# Altium schematic sheet DRIVERS_CONNECTORS.SchDoc: LEDBO - LTSN-N213EGBW (Drivers)
size B; Author: Sébastien Gélinas; Organization: SmartHalo; Address1: 5445 de Gaspé; Address2: Montréal, QC; Address3: Canada; Address4: H2T 3B2; Revision: 1; SheetNumber: 1; SheetTotal: 3
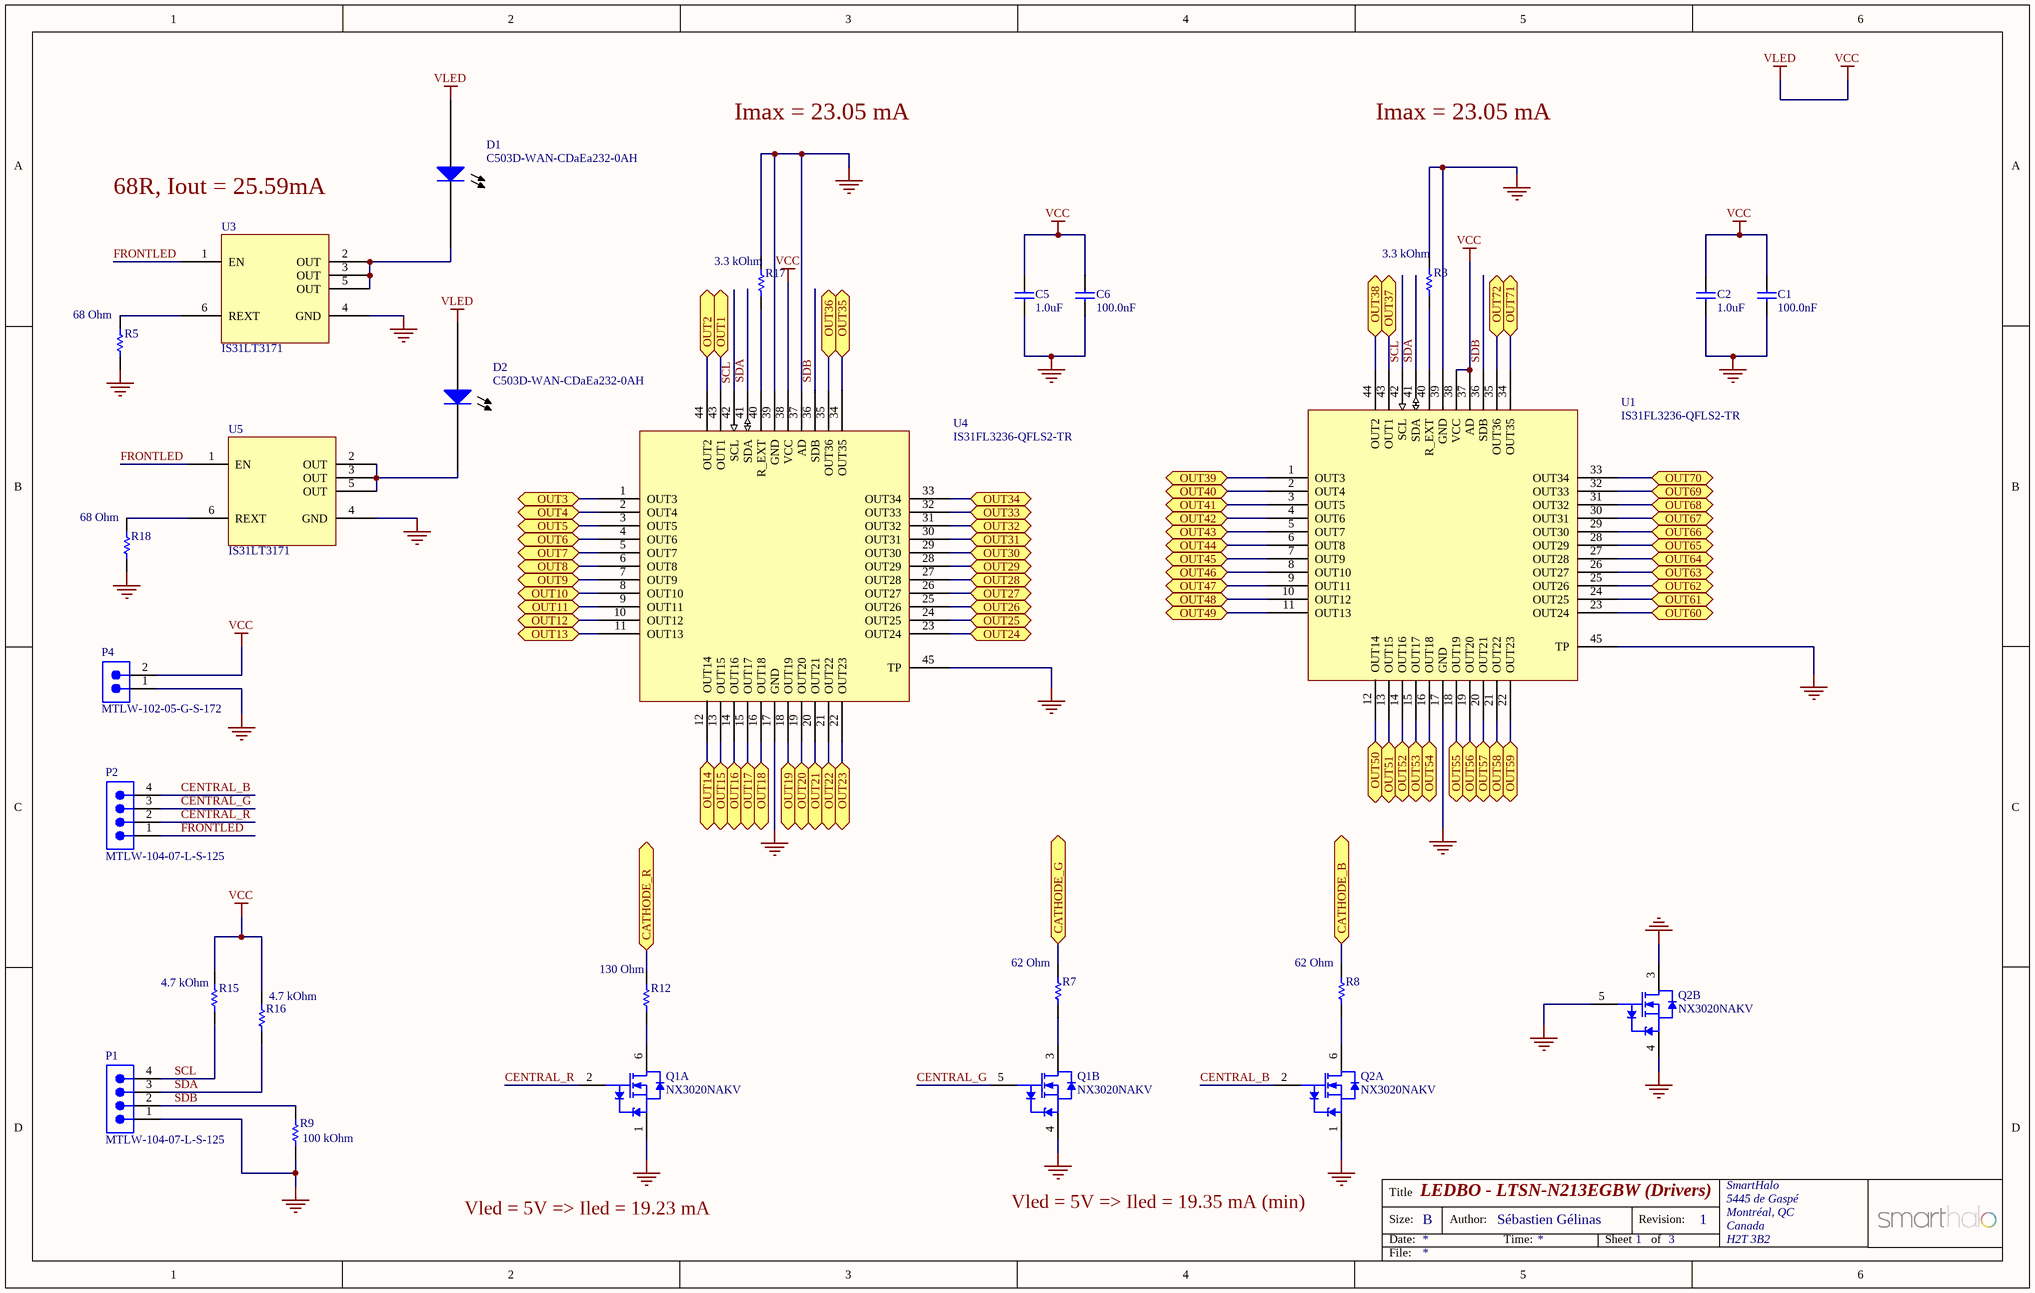
[diagram p0: DRIVERS_CONNECTORS.SchDoc]

## Parts
C1  100.0nF  [CAPC0603(1608)100_N]
C2  1.0uF  [CAPC0603(1608)100_N]
C5  1.0uF  [CAPC0603(1608)100_N]
C6  100.0nF  [CAPC0603(1608)100_N]
D1  C503D-WAN-CDaEa232-0AH  [FRONTLED_PADS]
D2  C503D-WAN-CDaEa232-0AH  [FRONTLED_PADS]
P1  MTLW-104-07-L-S-125  [SMTC-MTLW-104-07-X-S-125]  (no BOM)
P2  MTLW-104-07-L-S-125  [SMTC-MTLW-104-07-X-S-125]  (no BOM)
P4  MTLW-102-05-G-S-172  [SMTC-MTLW-102-05-X-S-172]  (no BOM)
Q1  NX3020NAKV  [SOT666]  (parts A,B of 2)
Q2  NX3020NAKV  [SOT666]  (parts A,B of 2)
R3  3.3 kOhm  [RESC0603(1608)_M]
R5  68 Ohm  [RESC0603(1608)_M]
R7  62 Ohm  [RESC0603(1608)_M]
R8  62 Ohm  [RESC0603(1608)_M]
R9  100 kOhm  [RESC0603(1608)_M]
R12  130 Ohm  [RESC0603(1608)_M]
R15  4.7 kOhm  [RESC0603(1608)_M]
R16  4.7 kOhm  [RESC0603(1608)_M]
R17  3.3 kOhm  [RESC0603(1608)_M]
R18  68 Ohm  [RESC0603(1608)_M]
U1  IS31FL3236-QFLS2-TR  [QFN-44]
U3  IS31LT3171  [SOT23-6]
U4  IS31FL3236-QFLS2-TR  [QFN-44]
U5  IS31LT3171  [SOT23-6]

## Ports
CATHODE_B, CATHODE_G, CATHODE_R, OUT1, OUT2, OUT3, OUT4, OUT5, OUT6, OUT7, OUT8, OUT9, OUT10, OUT11, OUT12, OUT13, OUT14, OUT15, OUT16, OUT17, OUT18, OUT19, OUT20, OUT21, OUT22, OUT23, OUT24, OUT25, OUT26, OUT27, OUT28, OUT29, OUT30, OUT31, OUT32, OUT33, OUT34, OUT35, OUT36, OUT37, OUT38, OUT39, OUT40, OUT41, OUT42, OUT43, OUT44, OUT45, OUT46, OUT47, OUT48, OUT49, OUT50, OUT51, OUT52, OUT53, OUT54, OUT55, OUT56, OUT57, OUT58, OUT59, OUT60, OUT61, OUT62, OUT63, OUT64, OUT65, OUT66, OUT67, OUT68, OUT69, OUT70, OUT71, OUT72

## Nets
GND: C1.2 C2.2 C5.2 C6.2 P1.1 P4.1 Q1.1(S1) Q1.4(S2) Q2.1(S1) Q2.3(D2) Q2.4(S2) Q2.5(G2) R3.2 R5.1 R9.1 R17.2 R18.1 U1.17(GND) U1.39(GND) U1.45(TP) U3.4(GND) U4.17(GND) U4.37(AD) U4.39(GND) U4.45(TP) U5.4(GND)
VCC: C1.1 C2.1 C5.1 C6.1 D1.1(Anode) D2.1(Anode) P4.2 R15.2 R16.2 U1.37(AD) U1.38(VCC) U4.38(VCC)  [also labelled VLED]
CATHODE_B: R8.2 ; port CATHODE_B
CATHODE_G: R7.2 ; port CATHODE_G
CATHODE_R: R12.2 ; port CATHODE_R
CENTRAL_B: P2.4 Q2.2(G1)
CENTRAL_G: P2.3 Q1.5(G2)
CENTRAL_R: P2.2 Q1.2(G1)
FRONTLED: P2.1 U3.1(EN) U5.1(EN)
OUT1: U4.43(OUT1) ; port OUT1
OUT2: U4.44(OUT2) ; port OUT2
OUT3: U4.1(OUT3) ; port OUT3
OUT4: U4.2(OUT4) ; port OUT4
OUT5: U4.3(OUT5) ; port OUT5
OUT6: U4.4(OUT6) ; port OUT6
OUT7: U4.5(OUT7) ; port OUT7
OUT8: U4.6(OUT8) ; port OUT8
OUT9: U4.7(OUT9) ; port OUT9
OUT10: U4.8(OUT10) ; port OUT10
OUT11: U4.9(OUT11) ; port OUT11
OUT12: U4.10(OUT12) ; port OUT12
OUT13: U4.11(OUT13) ; port OUT13
OUT14: U4.12(OUT14) ; port OUT14
OUT15: U4.13(OUT15) ; port OUT15
OUT16: U4.14(OUT16) ; port OUT16
OUT17: U4.15(OUT17) ; port OUT17
OUT18: U4.16(OUT18) ; port OUT18
OUT19: U4.18(OUT19) ; port OUT19
OUT20: U4.19(OUT20) ; port OUT20
OUT21: U4.20(OUT21) ; port OUT21
OUT22: U4.21(OUT22) ; port OUT22
OUT23: U4.22(OUT23) ; port OUT23
OUT24: U4.23(OUT24) ; port OUT24
OUT25: U4.24(OUT25) ; port OUT25
OUT26: U4.25(OUT26) ; port OUT26
OUT27: U4.26(OUT27) ; port OUT27
OUT28: U4.27(OUT28) ; port OUT28
OUT29: U4.28(OUT29) ; port OUT29
OUT30: U4.29(OUT30) ; port OUT30
OUT31: U4.30(OUT31) ; port OUT31
OUT32: U4.31(OUT32) ; port OUT32
OUT33: U4.32(OUT33) ; port OUT33
OUT34: U4.33(OUT34) ; port OUT34
OUT35: U4.34(OUT35) ; port OUT35
OUT36: U4.35(OUT36) ; port OUT36
OUT37: U1.43(OUT1) ; port OUT37
OUT38: U1.44(OUT2) ; port OUT38
OUT39: U1.1(OUT3) ; port OUT39
OUT40: U1.2(OUT4) ; port OUT40
OUT41: U1.3(OUT5) ; port OUT41
OUT42: U1.4(OUT6) ; port OUT42
OUT43: U1.5(OUT7) ; port OUT43
OUT44: U1.6(OUT8) ; port OUT44
OUT45: U1.7(OUT9) ; port OUT45
OUT46: U1.8(OUT10) ; port OUT46
OUT47: U1.9(OUT11) ; port OUT47
OUT48: U1.10(OUT12) ; port OUT48
OUT49: U1.11(OUT13) ; port OUT49
OUT50: U1.12(OUT14) ; port OUT50
OUT51: U1.13(OUT15) ; port OUT51
OUT52: U1.14(OUT16) ; port OUT52
OUT53: U1.15(OUT17) ; port OUT53
OUT54: U1.16(OUT18) ; port OUT54
OUT55: U1.18(OUT19) ; port OUT55
OUT56: U1.19(OUT20) ; port OUT56
OUT57: U1.20(OUT21) ; port OUT57
OUT58: U1.21(OUT22) ; port OUT58
OUT59: U1.22(OUT23) ; port OUT59
OUT60: U1.23(OUT24) ; port OUT60
OUT61: U1.24(OUT25) ; port OUT61
OUT62: U1.25(OUT26) ; port OUT62
OUT63: U1.26(OUT27) ; port OUT63
OUT64: U1.27(OUT28) ; port OUT64
OUT65: U1.28(OUT29) ; port OUT65
OUT66: U1.29(OUT30) ; port OUT66
OUT67: U1.30(OUT31) ; port OUT67
OUT68: U1.31(OUT32) ; port OUT68
OUT69: U1.32(OUT33) ; port OUT69
OUT70: U1.33(OUT34) ; port OUT70
OUT71: U1.34(OUT35) ; port OUT71
OUT72: U1.35(OUT36) ; port OUT72
SCL: P1.4 R15.1 U1.42(SCL) U4.42(SCL)
SDA: P1.3 R16.1 U1.41(SDA) U4.41(SDA)
SDB: P1.2 R9.2 U1.36(SDB) U4.36(SDB)
NetD1_2: D1.2(Cathode) U3.2(OUT) U3.3(OUT) U3.5(OUT)
NetD2_2: D2.2(Cathode) U5.2(OUT) U5.3(OUT) U5.5(OUT)
NetQ1_3: Q1.3(D2) R7.1
NetQ1_6: Q1.6(D1) R12.1
NetQ2_6: Q2.6(D1) R8.1
NetR3_1: R3.1 U1.40(R_EXT)
NetR5_2: R5.2 U3.6(REXT)
NetR17_1: R17.1 U4.40(R_EXT)
NetR18_2: R18.2 U5.6(REXT)

## Notes on the sheet
- Imax = 23.05 mA
- 68R, Iout = 25.59mA
- Vled = 5V => Iled = 19.23 mA
- Vled = 5V => Iled = 19.35 mA (min)
- Title
- Size:
- Date:
- B
- Author:
- Time:
- Sheet
- Revision:
- of
- File:

## Library data of the parts
C1 C2 C5 C6 = CAP0603: Chip Cap 0603 X7R 10%; Part Number: C0402-1n0; Note: Chip Cap X7R 10%; Artikkelnr Noca: 20039223; Published: 2009-05-08; LatestRevisionDate: 2009-11-23; Publisher: Nordic Semiconductor; Manufacturer: *; Manufacturer Part Number: *; Datasheet: *; Footprint: 0603; Pin Count: 2; Supplier: *
  C1 C6: Value: 100.0nF
  C2 C5: Value: 1.0uF
D1 D2 = C503D-WAN-CDaEa232-0AH: Cree 5mm Round LED C503D-WAN-CDaEa232-0AH; pin to pad: A>1 C>2; Manufacturer: Cree; Manufacturer Part Number: C503D-WAN-CDaEa232-0AH; Part Number: C503D-WAN-CDaEa232-0AH
P1 P2 = SMTC-MTLW-104-07-X-S-125: Low Profile .025" SQ Post Header, Through-hole, Vertical, -55 to 125 degC, 2.54 mm Pitch, 4-Pin, Male, RoHS; Manufacturer: Samtec; Pitch: 2.54 mm; PackageDescription: Low Profile Terminal Assembly; PartNumber: MTLW-104-07-L-S-125; PackageReference: MTLW-104-07-X-S-125; ComponentLink1Description: Manufacturer URL; ComponentLink2Description: Datasheet; ComponentLink2URL: http://www.samtec.com/documents/webfiles/pdf/MTLW_TH.PDF; ComponentLink3Description: Package Specification; Mounting Technology: Through-hole; ComponentLink3URL: http://www.samtec.com/documents/webfiles/cpdf/MTLW-1XX-XX-XX-X-XXX-XX-XX-MKT1.pdf; ComponentLink1URL: http://www.samtec.com; Orientation: Vertical; PackageVersion: T, 6/1991; DatasheetVersion: F-214; Temperature Range: -55 to 125 degC; RoHS: True
P4 = SMTC-MTLW-102-05-X-S-172: Low Profile .025" SQ Post Header, Through-hole, Vertical, -55 to 125 degC, 2.54 mm Pitch, 2-Pin, Male, RoHS; Manufacturer: Samtec; Pitch: 2.54 mm; ComponentLink2URL: http://www.samtec.com/documents/webfiles/pdf/MTLW_TH.PDF; PackageDescription: Low Profile Terminal Assembly; ComponentLink3URL: http://www.samtec.com/documents/webfiles/cpdf/MTLW-1XX-XX-XX-X-XXX-XX-XX-MKT1.pdf; PackageReference: MTLW-102-05-X-S-172; Mounting Technology: Through-hole; ComponentLink2Description: Datasheet; PackageVersion: T, 6/1991; Orientation: Vertical; DatasheetVersion: F-214; RoHS: True; ComponentLink3Description: Package Specification; ComponentLink1URL: http://www.samtec.com; Temperature Range: -55 to 125 degC; PartNumber: MTLW-102-05-G-S-172; ComponentLink1Description: Manufacturer URL
Q1 Q2 = NX3020NAKV: 30 V, 200 mA dual N-channel Trench MOSFET; Manufacturer: NXP Semiconductors
R3 R17 = CMP-1012-00090-1: 3K3 0.1W 5% 0603 (1608 Metric)  SMD; Case-Metric: 1608; Case-EIA: 0603; Tolerance: 5 %; Technology: SMT; Power: 0.1 W; Value: 3.3 kOhm
R5 R18 = CMP-1012-00090-1: 68R 0.1W 5% 0603 (1608 Metric)  SMD; Case-Metric: 1608; Case-EIA: 0603; Tolerance: 5 %; Technology: SMT; Power: 0.1 W; Value: 68 Ohm
R7 R8 = CMP-1012-00090-1: 62R 0.1W 5% 0603 (1608 Metric)  SMD; Case-Metric: 1608; Case-EIA: 0603; Tolerance: 5 %; Technology: SMT; Power: 0.1 W; Value: 62 Ohm
R9 = CMP-1012-00090-1: 100k 0.1W 5% 0603 (1608 Metric)  SMD; Case-Metric: 1608; Case-EIA: 0603; Tolerance: 5 %; Technology: SMT; Power: 0.1 W; Value: 100 kOhm
R12 = CMP-1012-00090-1: 130R 0.1W 5% 0603 (1608 Metric)  SMD; Case-Metric: 1608; Case-EIA: 0603; Tolerance: 5 %; Technology: SMT; Power: 0.1 W; Value: 130 Ohm
R15 R16 = CMP-1012-00090-1: 4K7 0.1W 5% 0603 (1608 Metric)  SMD; Case-Metric: 1608; Case-EIA: 0603; Tolerance: 5 %; Technology: SMT; Power: 0.1 W; Value: 4.7 kOhm
U1 U4 = IS31FL3236-QFLS2-TR: IC 36 CHANNELS LED DRIVER; Manufacturer: ISSI; Manufacturer Part Number: IS31FL3236-QFLS2-TR; Part Number: IS31FL3236-QFLS2-TR
U3 U5 = IS31LT3171: 10-TO-150MA CONSTANT-CURRENT LED DRIVER